# EasyEDA schematic EasyEDA Source.json
TITLE: Sheet_1; REV: 1.0; Date: 2026-02-06; Sheet: 1/1; Drawn By: nainika_l; Company: Your Company
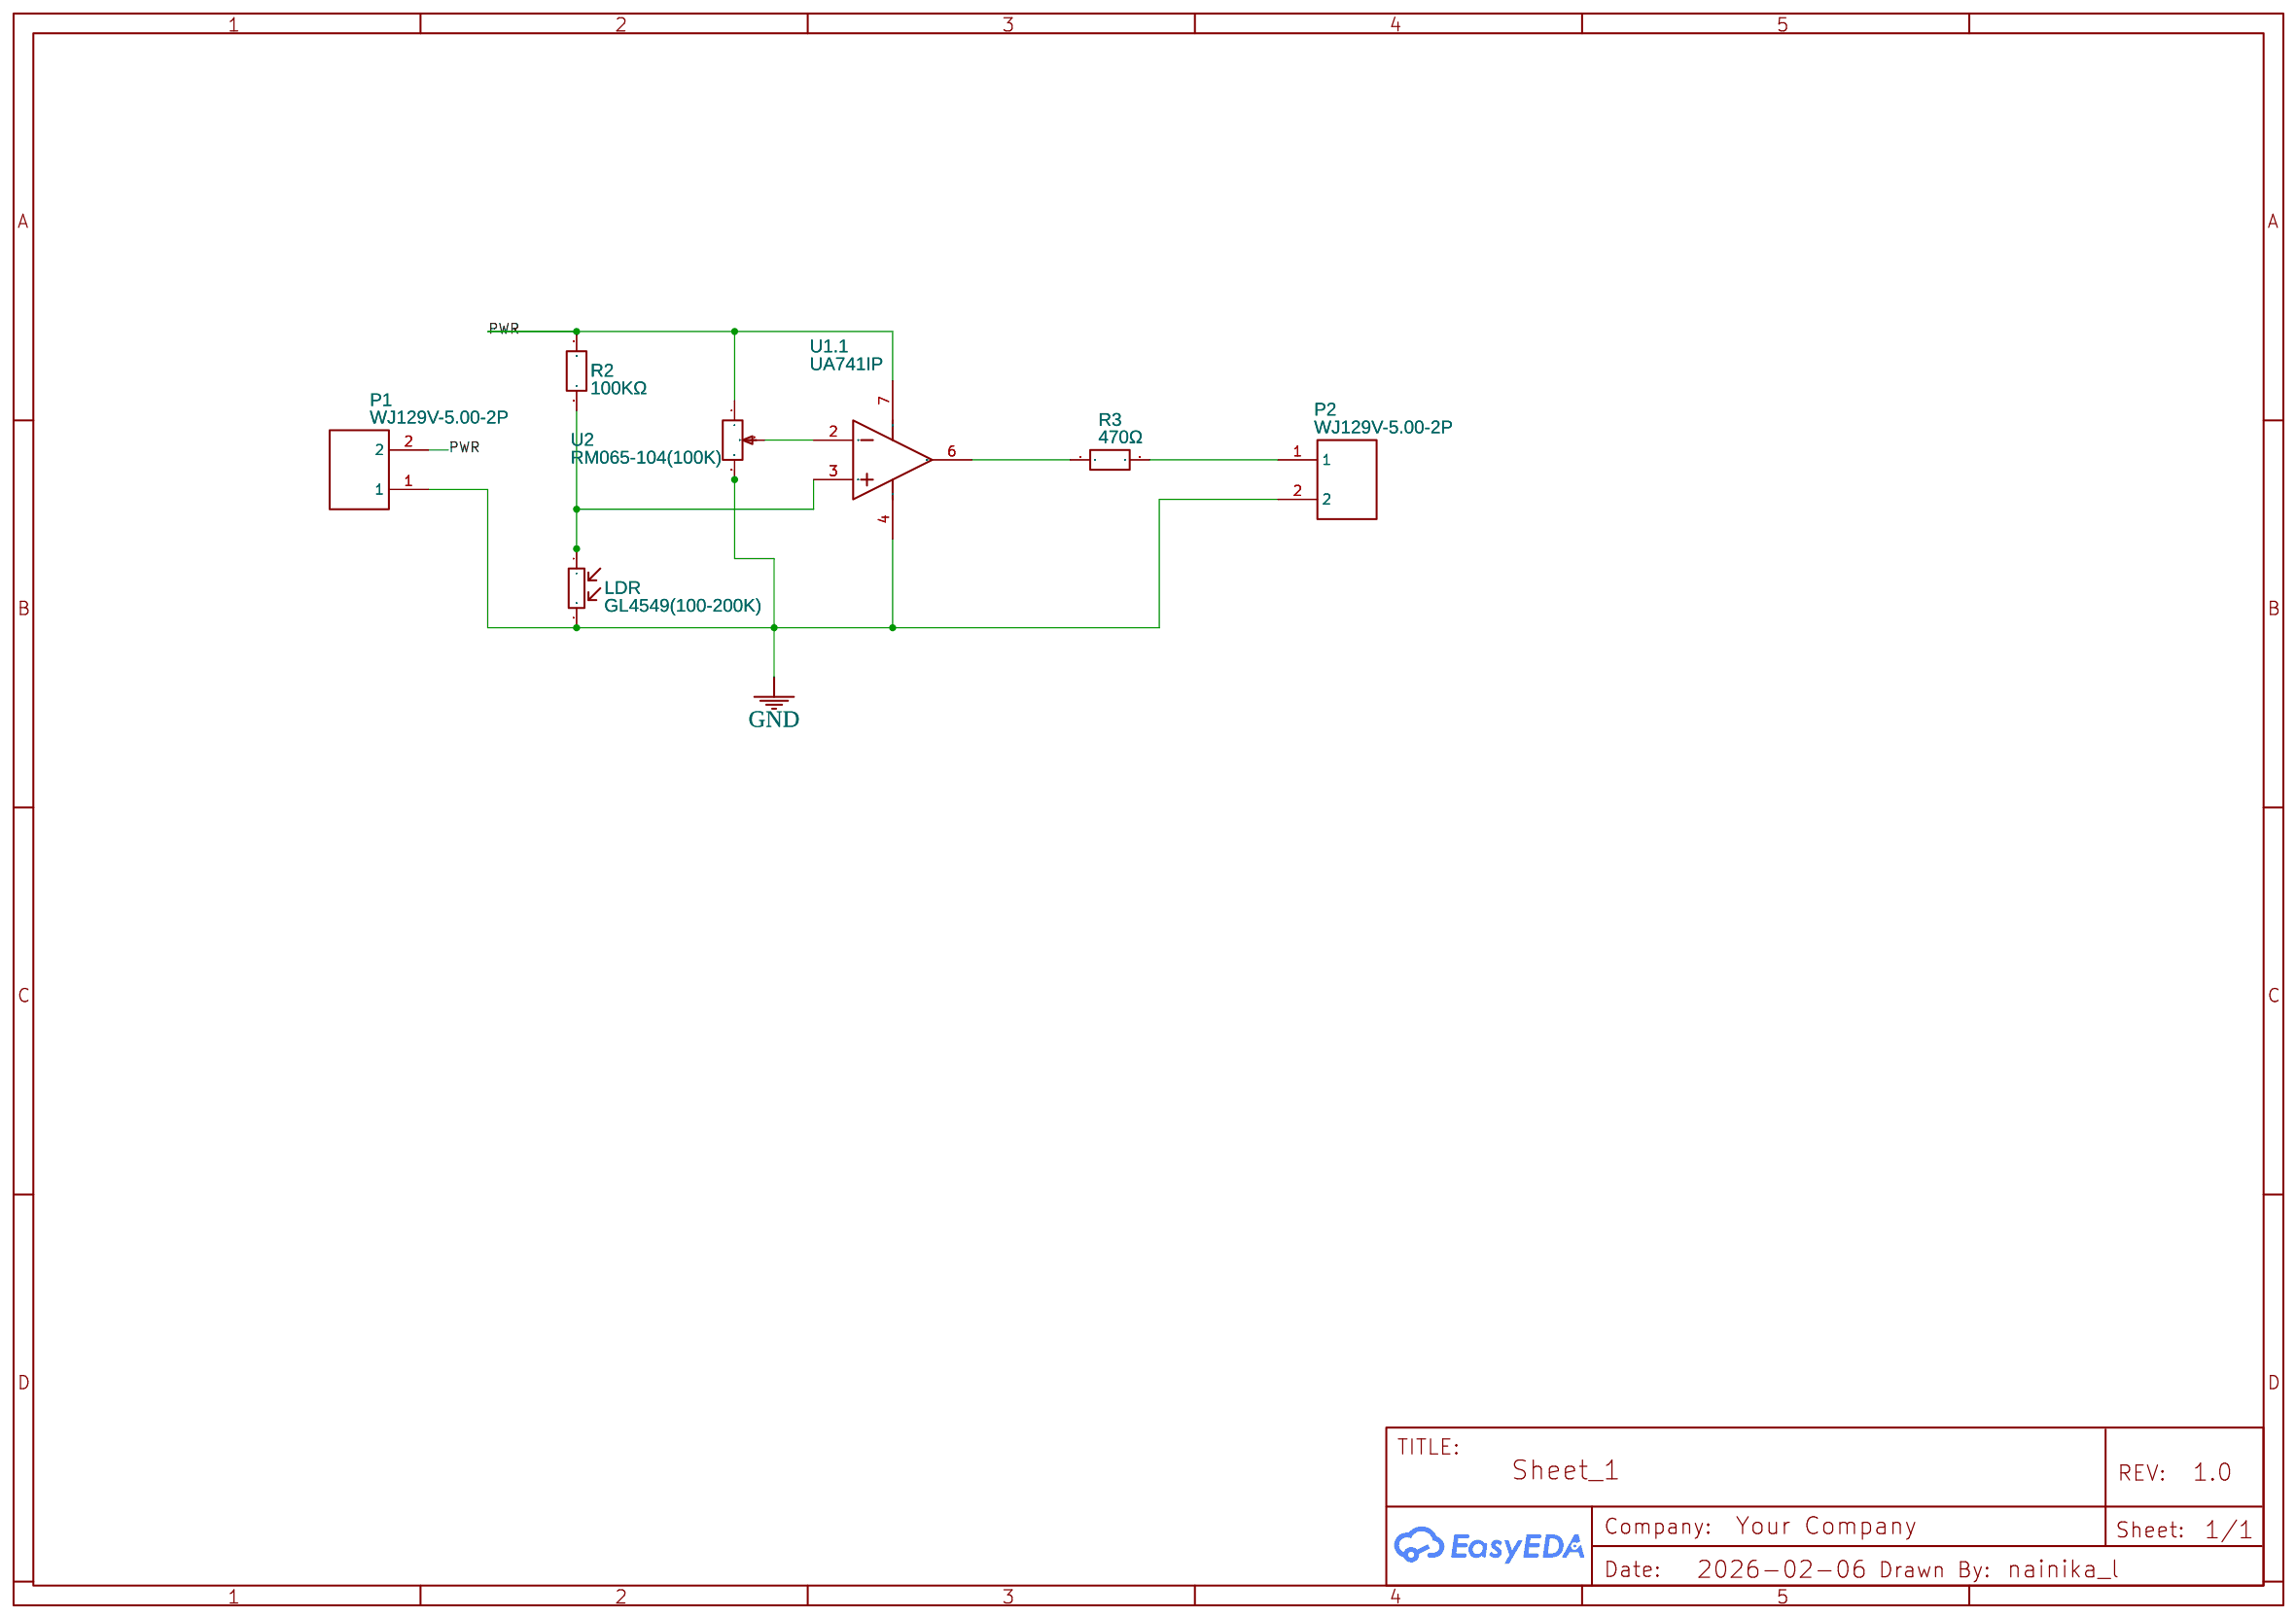
[diagram p0: schematic sheet]

## Parts
LDR  GL4549(100-200K)  [RES-TH_L4.1-W3.4-P2.50_GL45]
P1  WJ129V-5.00-2P  [CONN-TH_2P-P5.00_WJ129V-5.00-2P]
P2  WJ129V-5.00-2P  [CONN-TH_2P-P5.00_WJ129V-5.00-2P]
R2  100KΩ  [RES-TH_BD2.4-L6.4-P11.12-D0.6]
R3  470Ω  [RES-TH_BD2.4-L6.4-P11.12-D0.6]
U1  UA741IP  [PDIP-8_L9.3-W6.4-P2.54-LS7.9-BL-1]  (section 1)
U2  RM065-104(100K)  [RES-ADJ-SMD_RM065-V1]

## Library data of the parts
LDR = GL4549(100-200K): Supplier: LCSC; Manufacturer: JCHL(晶创和立); Manufacturer Part: GL4549（100-200K）; Supplier Part: C11298; JLCPCB Part Class: Extended Part
P1 P2 = WJ129V-5.00-2P: Supplier: LCSC; Manufacturer: KANGNEX(康奈克斯电气); Manufacturer Part: WJ129V-5.0-02P-14-00A; Supplier Part: C8463; JLCPCB Part Class: Extended Part
R2 R3 = MFR-25FBF52-200R: Supplier: LCSC; Supplier Part: C3455649; Manufacturer: YAGEO(国巨); JLCPCB Part Class: Extended Part; Contributor: lcsc
U1 = UA741IP: Supplier: LCSC; Supplier Part: C6343662; Manufacturer: TI(德州仪器); subpart_no: 1; JLCPCB Part Class: Extended Part
U2 = RM065-104(100K): Contributor: lcsc; Supplier: LCSC; Supplier Part: C5205024; Manufacturer: BOCHEN(博晨); JLCPCB Part Class: Extended Part

## Nets
GND: LDR.2 P1.1 P2.2 U1.4(VSS) U2.3
PWR: P1.2 R2.2 U1.7(VDD) U2.1
Net-(LDR-1): LDR.1 R2.1 U1.3(+IN)
Net-(P2-1): P2.1 R3.2
Net-(R3-1): R3.1 U1.6(OUT)
Net-(U1.1-2): U1.2(-IN) U2.2
